# EAGLE design SH-SN v1 (EAGLE 7.2.0)
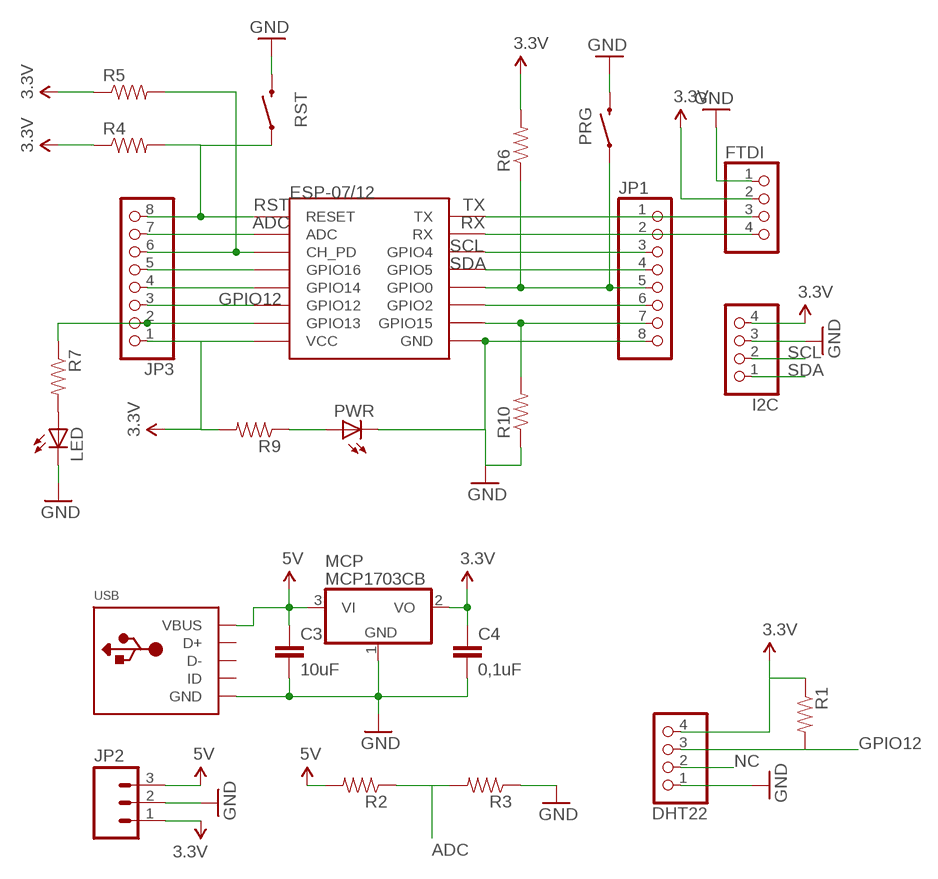
[diagram p0: schematic, sheet 1]

## Parts
C3  10uF  CAP0805  [0805]
C4  0,1uF  CAP0805  [0805]
DHT22  PINHD-1X4  [1X04]
ESP-07/12  ESP12SMD  [ESP12-SMD]
FTDI  PINHD-1X4  [1X04]
I2C  PINHD-1X4  [1X04]
JP1  PINHD-1X8  [1X08]
JP2  M03SCREW  [SCREWTERMINAL-3.5MM-3]
JP3  PINHD-1X8  [1X08]
LED  LEDCHIPLED_0805  [CHIPLED_0805]
MCP  MCP1703CB  [SOT23]
PRG  SWITCH-MOMENTARY-2SMD-REDUNDANT  [TACTILE-SWITCH-SMD]
PWR  LEDCHIPLED_0805  [CHIPLED_0805]
R1  RESISTOR0805-RES  [0805]
R2  RESISTOR0805-RES  [0805]
R3  RESISTOR0805-RES  [0805]
R4  RESISTOR0805-RES  [0805]
R5  RESISTOR0805-RES  [0805]
R6  RESISTOR0805-RES  [0805]
R7  RESISTOR0805-RES  [0805]
R9  RESISTOR0805-RES  [0805]
R10  RESISTOR0805-RES  [0805]
RST  SWITCH-MOMENTARY-2SMD-REDUNDANT  [TACTILE-SWITCH-SMD]
USB  USBMINIB  [USB-MINIB]

## Nets
3.3V: C4.1 ESP-07/12.VCC FTDI.2 I2C.4 JP2.1 JP3.1 MCP.2(VO) R4.1 R5.1 R6.2 R9.2
5V: C3.1 JP2.3 MCP.3(VI) R2.2 USB.VBUS
ADC: ESP-07/12.ADC JP3.7 R2.1 R3.2
GND: C3.2 C4.2 DHT22.1 ESP-07/12.GND FTDI.1 I2C.3 JP1.8 JP2.2 LED.C MCP.1(GND) PRG.3 PRG.4 PWR.C R3.1 R10.1 RST.3 RST.4 USB.GND
GPIO0: ESP-07/12.GPIO13 JP3.2 R7.1
GPIO12: DHT22.3 DHT22.4 ESP-07/12.GPIO12 JP3.3 R1.1 R1.2 ; supply symbol labelled 3.3V
N$2: ESP-07/12.GPIO14 JP3.4
N$4: ESP-07/12.GPIO2 JP1.6
N$5: ESP-07/12.GPIO0 JP1.5 PRG.1 PRG.2 R6.1
N$10: ESP-07/12.CH_PD JP3.6 R5.2
N$11: ESP-07/12.GPIO16 JP3.5
N$14: ESP-07/12.GPIO15 JP1.7 R10.2
N$16: LED.A R7.2
N$18: PWR.A R9.1
NC: DHT22.2
RST: ESP-07/12.RESET JP3.8 R4.2 RST.1 RST.2
RX: ESP-07/12.RXD0(RX) FTDI.4 JP1.2
SCL: ESP-07/12.GPIO4 I2C.2 JP1.3
SDA: ESP-07/12.GPIO5 I2C.1 JP1.4
TX: ESP-07/12.TXD0(TX) FTDI.3 JP1.1
Unconnected: USB.D+ USB.D- USB.ID

## Library data of the parts
C3 C4 = SparkFun-Capacitors:CAP: Capacitor Standard 0603 ceramic capacitor, and 0.1" leaded capacitor.
DHT22 FTDI I2C = pinhead:PINHD-1X4: PIN HEADER
ESP-07/12 = esp8266modules:ESP12: ESP8266 Wifi module 12
JP1 JP3 = pinhead:PINHD-1X8: PIN HEADER
JP2 = SparkFun-Connectors:M03: Header 3 Standard 3-pin 0.1" header. Use with straight break away headers (SKU : PRT-00116), right angle break away headers (PRT-00553), swiss pins (PRT-00743), machine pins (PRT-00117), and female headers (PRT-00115). Molex polarized connector foot print use with SKU : PRT-08232 with associated crimp pins and housings.
LED PWR = adafruit:LED: LED OSRAM: - CHIPLED LG R971, LG N971, LY N971, LG Q971, LY Q971, LO R971, LY R971 LH N974, LH R974 LS Q976, LO Q976, LY Q976 LO Q996 - Hyper CHIPLED LW Q18S LB Q993, LB Q99A, LB R99A - SideLED LS A670, LO A670, LY A670, LG A670, LP A670 LB A673, LV A673, LT A673, LW A673 LH A674 LY A675 LS A676, LA A676, LO A676, LY A676, LW A676 LS A679, LY A679, LG A679 - Hyper Micro SIDELED® LS Y876, LA Y876, LO Y876, LY Y876 LT Y87S - SmartLED LW L88C, LW L88S LB L89C, LB L89S, LG L890 LS L89K, LO L89K, LY L89K LS L896, LA L896, LO L896, LY L896 - TOPLED LS T670, LO T670, LY T670, LG T670, LP T670 LSG T670, LSP T670, LSY T670, LOP T670, LYG T670 LG T671, LOG T671, LSG T671 LB T673, LV T673, LT T673, LW T673 LH T674 LS T676, LA T676, LO T676, LY T676, LB T676, LH T676, LSB T676, LW T676 LB T67C, LV T67C, LT T67C, LS T67K, LO T67K, LY T67K, LW E67C LS E67B, LA E67B, LO E67B, LY E67B, LB E67C, LV E67C, LT E67C LW T67C LS T679, LY T679, LG T679 LS T770, LO T770, LY T770, LG T770, LP T770 LB T773, LV T773, LT T773, LW T773 LH T774 LS E675, LA E675, LY E675, LS T675 LS T776, LA T776, LO T776, LY T776, LB T776 LHGB T686 LT T68C, LB T68C - Hyper Mini TOPLED® LB M676 - Mini TOPLED Santana® LG M470 LS M47K, LO M47K, LY M47K Source: http://www.osram.convergy.de/
MCP = linear:MCP1703: 250 mA, 16V, Low Quiescent Current LDO Regulator Source: http://ww1.microchip.com/downloads/en/DeviceDoc/22049b.pdf
PRG RST = SparkFun-Electromechanical:SWITCH-MOMENTARY-2: Various NO switches- pushbuttons, reed, etc; PROD_ID: SWCH-08247
R1-R7 R9 R10 = SparkFun-Resistors:RESISTOR: Resistor Basic schematic elements and footprints for 0603, 1206, and PTH resistors.
USB = adafruit:USB: USB Connectors USBMINIB - Surface Mount Female Mini-B USB Connector 4UConnector: 06564 By microbuilder.eu Thru-hole RA Female Mini-B USB Connector 4UConnector: 18732 By ladyada.net

## Board
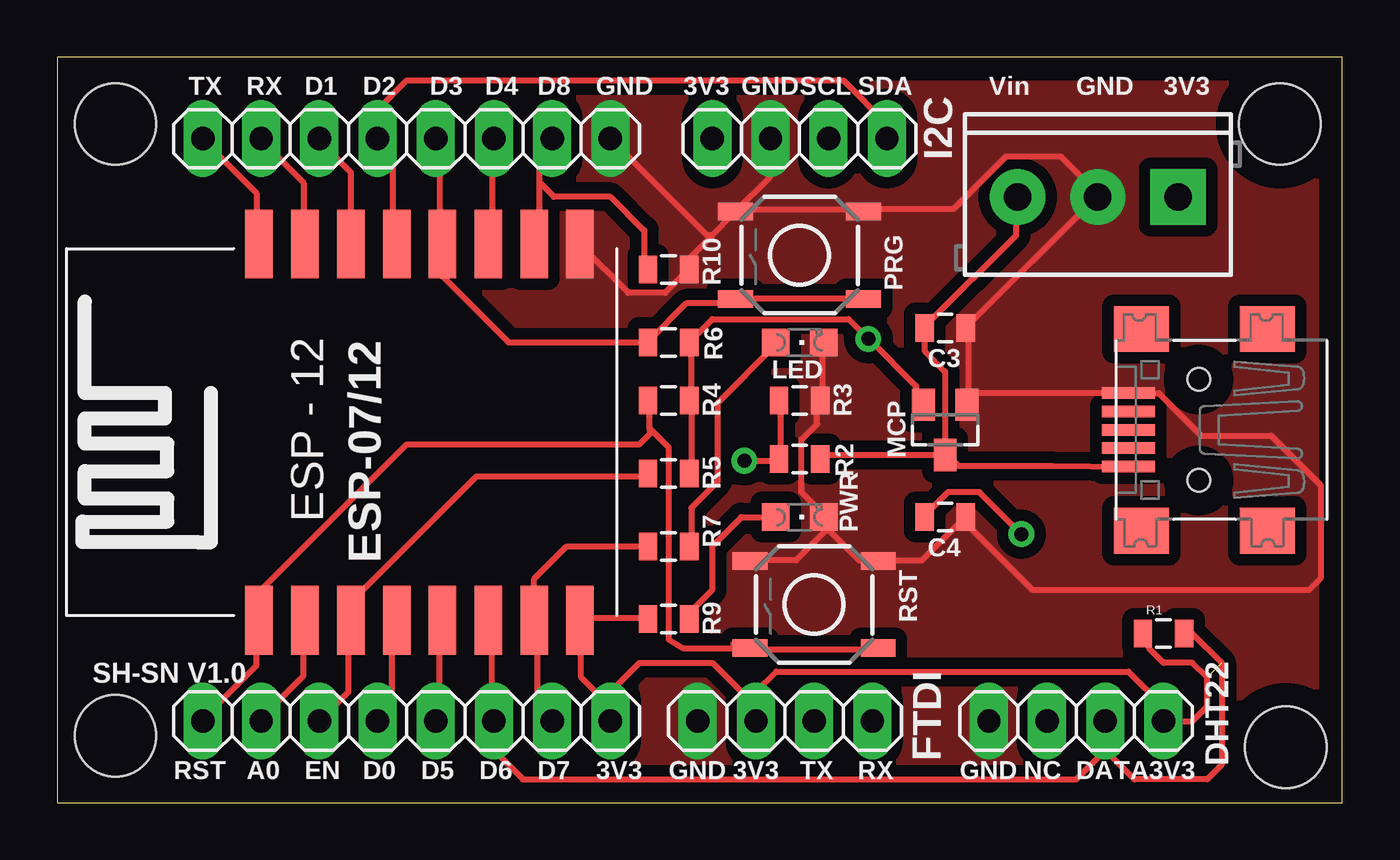
[diagram p1: board, top side]
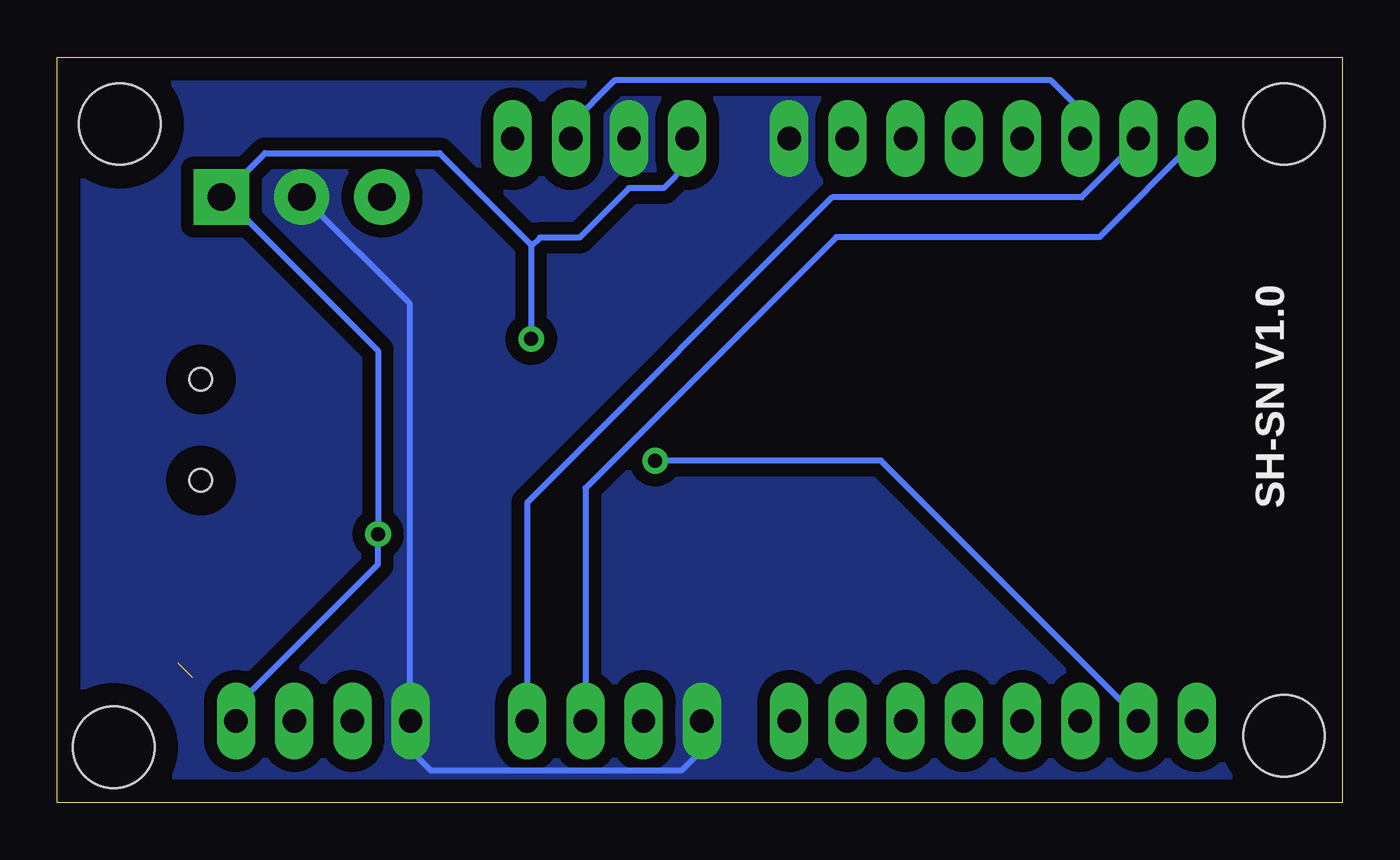
[diagram p2: board, bottom side, seen from below]

Size 56.06 x 32.5 mm. Coordinates in mm from the lower left corner, seen from the top.
Outline: 0,32.5 0,0 56.06,0 56.06,32.5 0,32.5
Copper layers (1*16): Top 0.035mm / dielectric 1.5mm / Bottom 0.035mm
Design rules "default *": minimum track width 10mil, minimum drill 24mil, track to track 10mil, track to pad 10mil, pad to pad 10mil, via to via 10mil, smd to smd 10mil, copper to edge 40mil, drill to drill 10mil, minimum pad ring 13mil, minimum via ring 10mil, stop-mask expansion 4mil, vias tented up to drill 0mil, thermal gap 10mil
Holes 3.56 mm at 2.54,29.59 2.54,2.92 53.59,2.41 53.34,29.59

### Footprints (pad centres in the part's own frame; a part is rotated, then mirrored left to right if it is on the bottom)
0805 = smd 0.8 x 1.2: 1 -0.9,0; 2 0.9,0
1X04 = drill 1.016 long: 1 -3.81,0; 2 -1.27,0; 3 1.27,0; 4 3.81,0
ESP12-SMD = smd 3 x 1.2: ADC -8.3,3.8; CH_PD -8.3,1.8; GND 8.1,-8.2; GPIO0 8.1,-2.2; GPIO2 8.1,-4.2; GPIO4 8.1,1.8; GPIO5 8.1,-0.2; GPIO12 -8.3,-4.2; GPIO13 -8.3,-6.2; GPIO14 -8.3,-2.2; GPIO15 8.1,-6.2; GPIO16 -8.3,-0.2; RESET -8.3,5.8; RXD0 8.1,3.8; TXD0 8.1,5.8; VCC -8.3,-8.2
1X08 = drill 1.016 long: 1 -8.89,0; 2 -6.35,0; 3 -3.81,0; 4 -1.27,0; 5 1.27,0; 6 3.81,0; 7 6.35,0; 8 8.89,0
SCREWTERMINAL-3.5MM-3 = drill 1.2 pad 2.413 square: 1 0,0 | drill 1.2 pad 2.413: 2 3.5,0; 3 7,0
CHIPLED_0805 = smd 1.2 x 1.2: A 0,-1.05; C 0,1.05
SOT23 = smd 1 x 1.4: 1 -0.95,-1.1; 2 0.95,-1.1; 3 0,1.1
TACTILE-SWITCH-SMD = smd 1.524 x 0.762: 1 -2.794,1.905; 2 2.794,1.905; 3 -2.794,-1.905; 4 2.794,-1.905
USB-MINIB = smd 0.5 x 2.308: D+ 0,4.064; D- -0.8,4.064; GND 1.6,4.064; ID 0.8,4.064; VBUS -1.6,4.064 | smd 2 x 2.4: GND1 -4.4,-2; GND2 -4.4,3.5; GND3 4.4,3.5; GND4 4.4,-2 | hole 1: -2.2,1; 2.2,1

### Placement (x,y rotation side)
C3  38.73,20.7 0 top
C4  38.73,12.45 0 top
DHT22  44.45,3.56 0 top
ESP-07/12  14.61,16.26 90 top
FTDI  31.75,3.56 0 top
I2C  32.39,28.96 180 top
JP1  15.24,28.96 0 top
JP2  48.89,26.42 180 top
JP3  15.24,3.56 180 top
LED  32.39,20.07 270 top
MCP  38.73,16.26 180 top
PRG  32.39,23.88 180 top
PWR  32.39,12.45 270 top
R1  48.26,7.37 0 top
R2  32.39,14.99 0 top
R3  32.39,17.53 180 top
R4  26.67,17.53 180 top
R5  26.67,14.35 180 top
R6  26.67,20.07 0 top
R7  26.67,11.18 0 top
R9  26.67,8 180 top
R10  26.67,23.24 180 top
RST  33.02,8.64 180 top
USB  50.8,16.26 90 top

### Tracks (layer width: path | path; a pad name or v marks a point on that pad's centre or on a via)
3.3V  (via drill 0.61)
  Top 0.254: R9.2 25.6,8.05 22.86,8.05 ESP-07/12.VCC 22.86,7.9 22.86,5.46 24.13,4.19 | 30.4,3.71 FTDI.2 30.48,4.19 | v42.06,11.71 40.23,13.54 38.86,13.54 37.95,12.62 C4.1 | R5.1 27.66,14.45 27.66,17.42 R4.1 27.66,17.65 27.66,19.94 R6.2 27.66,20.17 28.57,21.08 34.52,21.08 v35.38,20.22 35.41,20.22 37.47,18.16 37.47,17.68 MCP.2 37.72,17.42 | JP3.1 24.13,4.19 | 24.13,4.19 24.16,4.19 24.16,4.85 25.4,6.1 28.57,6.1 30.48,4.19 | 30.48,4.19 30.48,4.83 31.37,5.71 46.74,5.71 48.26,4.19 v48.26,3.56
  Bottom 0.254: 35.38,24.26 35.38,24.33 39.37,28.32 46.99,28.32 JP2.1 48.69,26.34 42.06,19.71 v42.06,11.71 42.06,10.39 48.26,4.19 v48.26,3.56 | 35.38,24.26 v35.38,20.22 | I2C.4 28.57,27.81 29.59,26.8 31.11,26.8 33.27,24.64 35,24.64 35.38,24.26
5V
  Top 0.254: R2.2 33.38,15.14 38.63,15.14 MCP.3 | USB.VBUS 43.43,14.68 39.32,14.68 38.86,15.14 MCP.3 | JP2.3 41.83,26.34 41.83,24.74 37.95,20.85 C3.1 37.83,19.7 38.73,18.8 MCP.3
ADC  (via drill 0.61)
  Top 0.254: R3.2 31.55,17.42 31.55,15.14 R2.1 31.32,14.91 v29.97,14.91 | ESP-07/12.ADC 10.74,7.82 10.74,5.54 8.92,3.71 JP3.7
  Bottom 0.254: v29.97,14.91 20.12,14.91 8.92,3.71 JP3.7
GND
  Top 0.254: 28.57,24.74 29.49,25.65 PRG.4 | 28.57,24.74 27.66,23.83 27.66,23.37 R10.1 27.43,23.14 26.52,22.23 24.92,22.23 22.86,24.28 ESP-07/12.GND | PRG.4 29.72,25.88 34.98,25.88 PRG.3 35.2,25.88 39.09,25.88 41.38,28.17 43.79,28.17 45.44,26.52 | JP1.8 28.35,24.74 28.57,24.74 | I2C.3 31.09,28.85 31.09,27.28 PRG.4 | LED.C 33.38,19.94 33.38,17.65 R3.1 33.15,17.42 33.15,16.51 32.46,15.82 32.46,13.54 33.38,12.62 PWR.C | 33.6,11.94 33.6,12.39 PWR.C | 33.6,11.94 34.98,10.57 RST.3 35.2,10.57 37.72,10.57 39.55,12.39 C4.2 | 33.6,11.94 32.23,10.57 29.72,10.57 RST.4 | 33.6,11.94 PWR.C | 39.78,17.88 39.78,17.42 MCP.1 39.78,17.88 | 39.78,17.88 39.78,20.62 C3.2 39.78,20.85 45.26,26.34 | 45.26,26.34 45.44,26.52 | 45.26,26.34 JP2.2 45.44,26.52 | 39.78,12.39 C4.2 | USB.GND 45.39,17.86 | 39.78,17.88 46.71,17.88 USB.GND | C4.2 39.64,12.18 42.55,9.27 54.61,9.27 55.12,9.78 55.12,13.84 52.96,16 49.91,16 48.06,17.86 USB.GND
  Bottom 0.254: 40.69,3.61 40.69,21.77 45.26,26.34 JP2.2 | FTDI.1 27.94,2.29 28.83,1.4 39.75,1.4 40.64,2.29 DHT22.1
  pour Bottom (isolate 0.559, no thermals): -3.81,35.31 59.05,35.31 59.05,-3.43 -3.81,-3.43
  pour Top (isolate 0.508, no thermals): -3.81,35.31 59.05,35.31 59.05,-3.43 -3.81,-3.43
GPIO0
  Top 0.254: JP3.2 20.96,4.19 20.96,7.81 ESP-07/12.GPIO13 20.8,9.76 22.23,11.18 R7.1
GPIO12  (1 unrouted)
  Top 0.254: ESP-07/12.GPIO12 18.97,7.82 18.97,3.71 JP3.3 19.05,2.29 20.32,1.02 44.45,1.02 45.72,2.29 | 45.72,2.29 DHT22.3 | R1.2 49.53,7.37 50.8,6.1 50.8,1.65 50.17,1.02 46.99,1.02 45.72,2.29 | DHT22.4 49.53,3.56 50.17,4.19 50.17,5.46 49.53,6.1 48.26,6.1 47.62,6.73 47.62,7.1 R1.1
N$2
  Top 0.254: ESP-07/12.GPIO14 16.69,7.82 16.69,3.71 JP3.4
N$4
  Top 0.254: ESP-07/12.GPIO2 18.97,24.51 18.97,28.85 JP1.6
N$5
  Top 0.254: JP1.5 16.69,28.85 16.69,24.51 ESP-07/12.GPIO0 16.8,22.95 19.68,20.07 R6.1 25.83,20.17 27.43,21.77 29.49,21.77 PRG.2 29.72,22 34.98,22 PRG.1
N$10
  Top 0.254: R5.2 25.6,14.22 18.29,14.22 13.03,8.97 13.03,8.05 ESP-07/12.CH_PD 12.7,7.85 12.7,4.83 JP3.6
N$11
  Top 0.254: JP3.5 14.61,4.19 14.61,7.76 ESP-07/12.GPIO16
N$14
  Top 0.254: R10.2 25.6,23.37 25.6,24.97 25.58,24.97 24.13,26.42 21.67,26.42 21.03,27.05 | 21.72,28.85 JP1.7 21.03,28.4 21.03,27.05 | ESP-07/12.GPIO15 21.03,24.51 21.03,27.05
N$16
  Top 0.254: R7.2 27.66,11.25 27.66,12.85 28.8,14 28.8,17.42 31.32,19.94 LED.A
N$18
  Top 0.254: 31.11,12.23 PWR.A 29.85,12.45 28.57,11.18 28.57,9.27 27.57,8.27 R9.1
RST
  Top 0.254: JP3.8 6.4,3.71 8.69,5.99 8.69,7.82 ESP-07/12.RESET 8.92,8.05 8.92,9.3 15.24,15.62 25.4,15.62 25.83,16.05 25.83,16.33 | 25.83,16.33 25.83,17.42 R4.2 | 29.49,6.91 RST.2 | RST.1 34.98,6.68 29.72,6.68 RST.2 | 25.83,16.33 26.67,15.49 26.67,7.11 27.31,6.73 RST.2
RX
  Top 0.254: ESP-07/12.RXD0 10.74,24.51 10.74,27.03 8.92,28.85 JP1.2
  Bottom 0.254: 35.43,3.71 FTDI.4 35.56,13.08 22.25,26.39 11.38,26.39 8.92,28.85 JP1.2
SCL
  Top 0.254: ESP-07/12.GPIO4 12.8,24.51 12.8,27.48 11.43,28.85 JP1.3
  Bottom 0.254: 33.6,29.08 I2C.2 33.66,29.59 31.75,31.5 12.7,31.5 11.43,30.23 JP1.3
SDA
  Top 0.254: ESP-07/12.GPIO5 14.63,24.51 14.63,28.4 14.17,28.85 JP1.4 13.97,30.23 15.24,31.5 34.29,31.5 36.19,29.59 I2C.1 36.12,29.08
TX
  Top 0.254: ESP-07/12.TXD0 8.69,24.51 8.69,26.57 6.4,28.85 JP1.1
  Bottom 0.254: 32.92,3.71 FTDI.3 33.02,13.72 22.07,24.66 10.59,24.66 6.4,28.85 JP1.1

### Text on the board
tNames: TX | RX | D1 | D2 | D3 | D4 | D8 | GND | 3V3 | GND | SCL | SDA | Vin | GND | 3V3 | SH-SN V1.0 | RST | A0 | EN | D0 | D5 | D6 | D7 | 3V3 | GND | 3V3 | TX | RX | GND | NC | DATA | 3V3
bNames: SH-SN V1.0